# EAGLE design Ideal Diode (EAGLE 7.1.0)
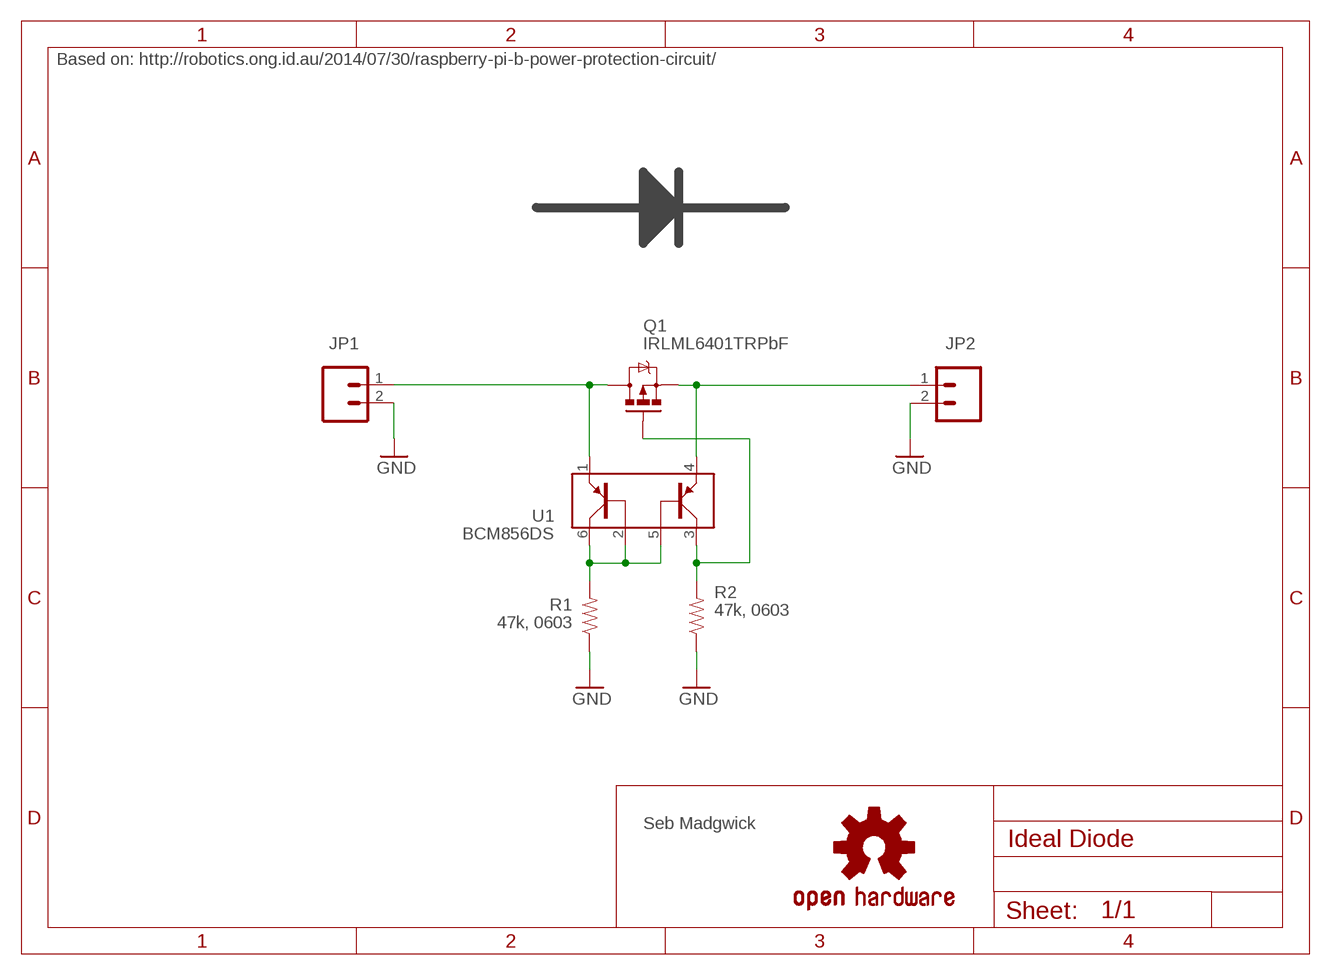
[diagram p0: schematic, sheet 1]

## Parts
JP1  M02PTH3  [1X02_LONGPADS]
JP2  M02PTH3  [1X02_LONGPADS]
LOGO1  OSHW-LOGOS  [OSHW-LOGO-S]
Q1  IRLML6401TRPbF  MOSFET-PCHANNEL  [SOT23-3]
R1  47k, 0603  RESISTOR0603  [0603-RES]
R2  47k, 0603  RESISTOR0603  [0603-RES]
U1  BCM856DS  BCM856-MIRRORDS  [SOT457]

## Nets
GND: JP1.2 JP2.2 R1.1 R2.1
N$1: R1.2 U1.2 U1.5 U1.6
N$2: Q1.1(G) R2.2 U1.3
N$5: JP2.1 Q1.2(S) U1.4
N$6: JP1.1 Q1.3(D) U1.1

## Notes on the sheet
- Based on: http://robotics.ong.id.au/2014/07/30/raspberry-pi-b-power-protection-circuit/
- Seb Madgwick

## Library data of the parts
JP1 JP2 = SparkFun-Connectors:M02: Standard 2-pin 0.1" header. Use with - straight break away headers ( PRT-00116) - right angle break away headers (PRT-00553) - swiss pins (PRT-00743) - machine pins (PRT-00117) - female headers (PRT-00115) Molex polarized connector foot print use with: PRT-08233 with associated crimp pins and housings. 2.54_SCREWTERM for use with PRT-10571. 3.5mm Screw Terminal footprints for PRT-08084 5mm Screw Terminal footprints for use with PRT-08432
LOGO1 = SparkFun-Aesthetics:OSHW-LOGO: Open Source Hardware Logo This logo indicates the piece of hardware it is found on incorporates a OSHW license and/or adheres to the definition of open source hardware found here: http://freedomdefined.org/OSHW
Q1 = SparkFun-DiscreteSemi:MOSFET-PCHANNEL: Generic PMOSFET IRLML2244 - TRANS-11153 (SOT-23 -20V -4.3A) (1.Gate 2.Source 3.Drain) FQP27P06 - COM-10349 <http://www.sparkfun.com/products/10349> (TO-220 -60V -27A) (1.Gate 2.Source 3.Drain); PROD_ID: TRANS-08285
R1 R2 = SparkFun-Resistors:RESISTOR: Resistor Basic schematic elements and footprints for 0603, 1206, and PTH resistors.
U1 = x-io:BCM856-MIRROR

## Board
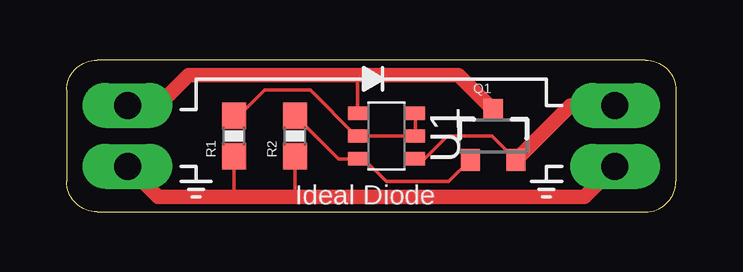
[diagram p1: board, top side]
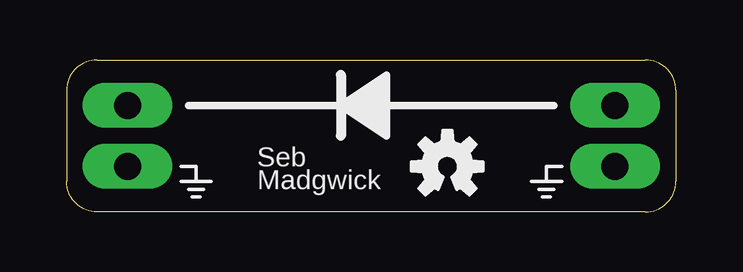
[diagram p2: board, bottom side, seen from below]

Size 25.4 x 6.35 mm. Coordinates in mm from the lower left corner, seen from the top.
Outline: 1.27,0 24.13,0 arc90 25.4,1.27 25.4,5.08 arc90 24.13,6.35 1.27,6.35 arc90 0,5.08 0,1.27 arc90 1.27,0
Copper layers (1*16): Top 0.035mm / dielectric 1.5mm / Bottom 0.035mm
Design rules "default": minimum track width 10mil, minimum drill 24mil, track to track 8mil, track to pad 8mil, pad to pad 8mil, via to via 8mil, smd to smd 8mil, copper to edge 40mil, drill to drill 8mil, minimum pad ring 10mil, minimum via ring 8mil, stop-mask expansion 4mil, vias tented up to drill 0mil, thermal gap 10mil

### Footprints (pad centres in the part's own frame; a part is rotated, then mirrored left to right if it is on the bottom)
1X02_LONGPADS = drill 1.118 pad 1.88 long: 1 0,0; 2 2.54,0
SOT23-3 = smd 0.8 x 0.9: 1 -0.95,-1; 2 0.95,-1; 3 0,1.1
0603-RES = smd 1.1 x 1: 1 -0.85,0; 2 0.85,0
SOT457 = smd 0.55 x 0.8: 1 -0.95,-1.2; 2 0,-1.2; 3 0.95,-1.2; 4 0.95,1.2; 5 0,1.2; 6 -0.95,1.2

### Placement (x,y rotation side)
JP1  2.54,4.45 270 top
JP2  22.86,4.45 270 top
LOGO1  9.53,1.91 0 bottom
Q1  17.78,3.17 0 top
R1  6.99,3.17 90 top
R2  9.53,3.17 90 top
U1  13.34,3.17 270 top

### Tracks (layer width: path | path; a pad name or v marks a point on that pad's centre or on a via)
GND
  Top 0.152: R1.1 6.99,0.64 | R2.1 9.53,0.64
  Top 0.61: JP1.2 3.81,0.64 6.99,0.64 9.53,0.64 21.59,0.64 JP2.2
N$1
  Top 0.152: U1.6 U1.5 U1.2 12.06,3.17 10.16,5.08 8.26,5.08 7.41,4.23 7.41,4.03 R1.2
N$2
  Top 0.152: R2.2 11.32,2.23 U1.3 12.38,2.23 13.34,1.27 15.93,1.27 Q1.1
N$5
  Top 0.152: 14.29,2.23 U1.4 14.93,2.23 15.88,3.17 17.73,3.17 Q1.2
  Top 0.61: JP2.1 21,4.45 Q1.2
N$6
  Top 0.152: U1.1 12.13,5.64 12.06,5.71
  Top 0.61: JP1.1 3.81,4.45 5.08,5.71 12.06,5.71 16.34,5.71 Q1.3

### Text on the board
tPlace: Ideal Diode
bPlace: Seb | Madgwick